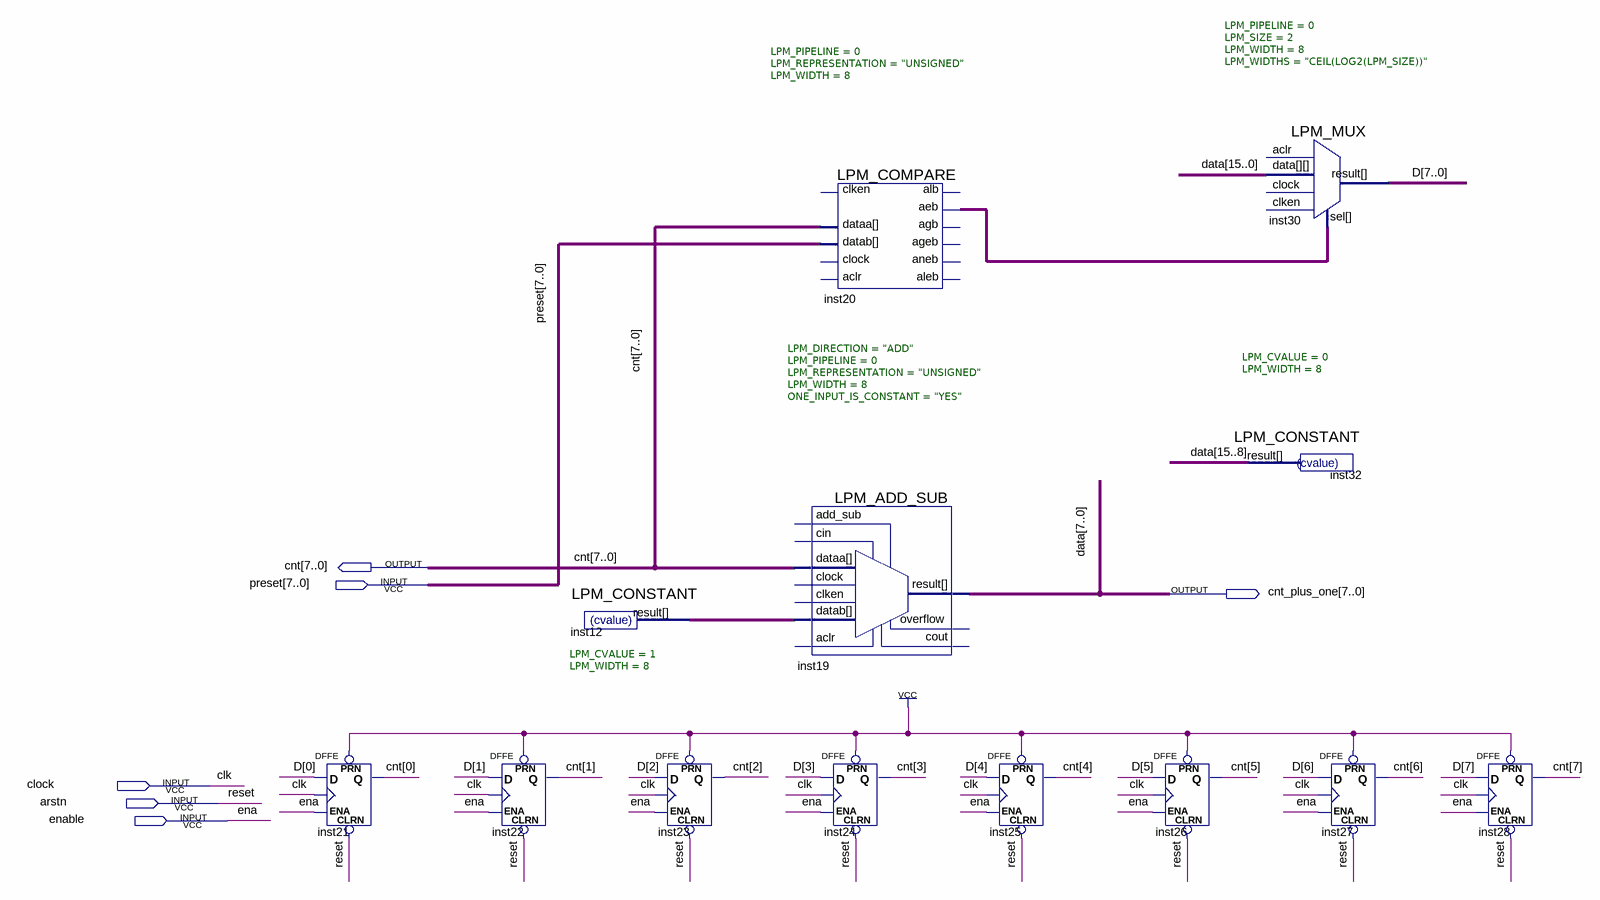
[diagram p0: schematic sheet]
// Quartus schematic Counter.bdf as structural Verilog: 13 symbols, 6 pins
module Counter (
  input  [7:0] preset,
  input  clock,
  input  arstn,
  input  enable,
  output [7:0] cnt,
  output [7:0] cnt_plus_one
);

  wire inst20_aeb;
  wire [7:0] D, inst12_result;
  wire [15:8] data;

  DFFE inst21 (.PRN(1'b1), .CLRN(arstn), .D(D[0]), .CLK(clock), .ENA(enable), .Q(cnt[0]));
  DFFE inst22 (.PRN(1'b1), .CLRN(arstn), .D(D[1]), .CLK(clock), .ENA(enable), .Q(cnt[1]));
  LPM_CONSTANT #(.LPM_CVALUE(1), .LPM_WIDTH(8)) inst12 (.result(inst12_result));
  DFFE inst23 (.PRN(1'b1), .CLRN(arstn), .D(D[2]), .CLK(clock), .ENA(enable), .Q(cnt[2]));
  LPM_COMPARE #(.LPM_PIPELINE(0), .LPM_REPRESENTATION("UNSIGNED"), .LPM_WIDTH(8)) inst20 (
    .dataa(cnt), .datab(preset), .aeb(inst20_aeb));  // open: clock, aclr, clken, aleb, agb, aneb, ageb, alb
  LPM_ADD_SUB #(.LPM_DIRECTION("ADD"), .LPM_PIPELINE(0), .LPM_REPRESENTATION("UNSIGNED"), .LPM_WIDTH(8), .ONE_INPUT_IS_CONSTANT("YES")) inst19 (
    .datab(inst12_result), .dataa(cnt), .result(cnt_plus_one));  // open: add_sub, cin, aclr, clock, clken, cout, overflow
  DFFE inst24 (.PRN(1'b1), .CLRN(arstn), .D(D[3]), .CLK(clock), .ENA(enable), .Q(cnt[3]));
  DFFE inst25 (.PRN(1'b1), .CLRN(arstn), .D(D[4]), .CLK(clock), .ENA(enable), .Q(cnt[4]));
  DFFE inst26 (.PRN(1'b1), .CLRN(arstn), .D(D[5]), .CLK(clock), .ENA(enable), .Q(cnt[5]));
  LPM_MUX #(.LPM_PIPELINE(0), .LPM_SIZE(2), .LPM_WIDTH(8), .LPM_WIDTHS("CEIL(LOG2(LPM_SIZE))")) inst30 (
    .data({data, cnt_plus_one}), .sel(inst20_aeb), .result(D));  // open: clock, aclr, clken
  LPM_CONSTANT #(.LPM_CVALUE(0), .LPM_WIDTH(8)) inst32 (.result(data));
  DFFE inst27 (.PRN(1'b1), .CLRN(arstn), .D(D[6]), .CLK(clock), .ENA(enable), .Q(cnt[6]));
  DFFE inst28 (.PRN(1'b1), .CLRN(arstn), .D(D[7]), .CLK(clock), .ENA(enable), .Q(cnt[7]));

  // Other names for the same wires on the sheet: clk = clock; data[7:0] = cnt_plus_one; ena = enable; reset = arstn
endmodule
